# EasyEDA schematic EaseEDA_Stand_Kovalenko.json
TITLE: Stand; REV: 1.0; Date: 2021-12-19; Sheet: 1/1; Company: Your Company
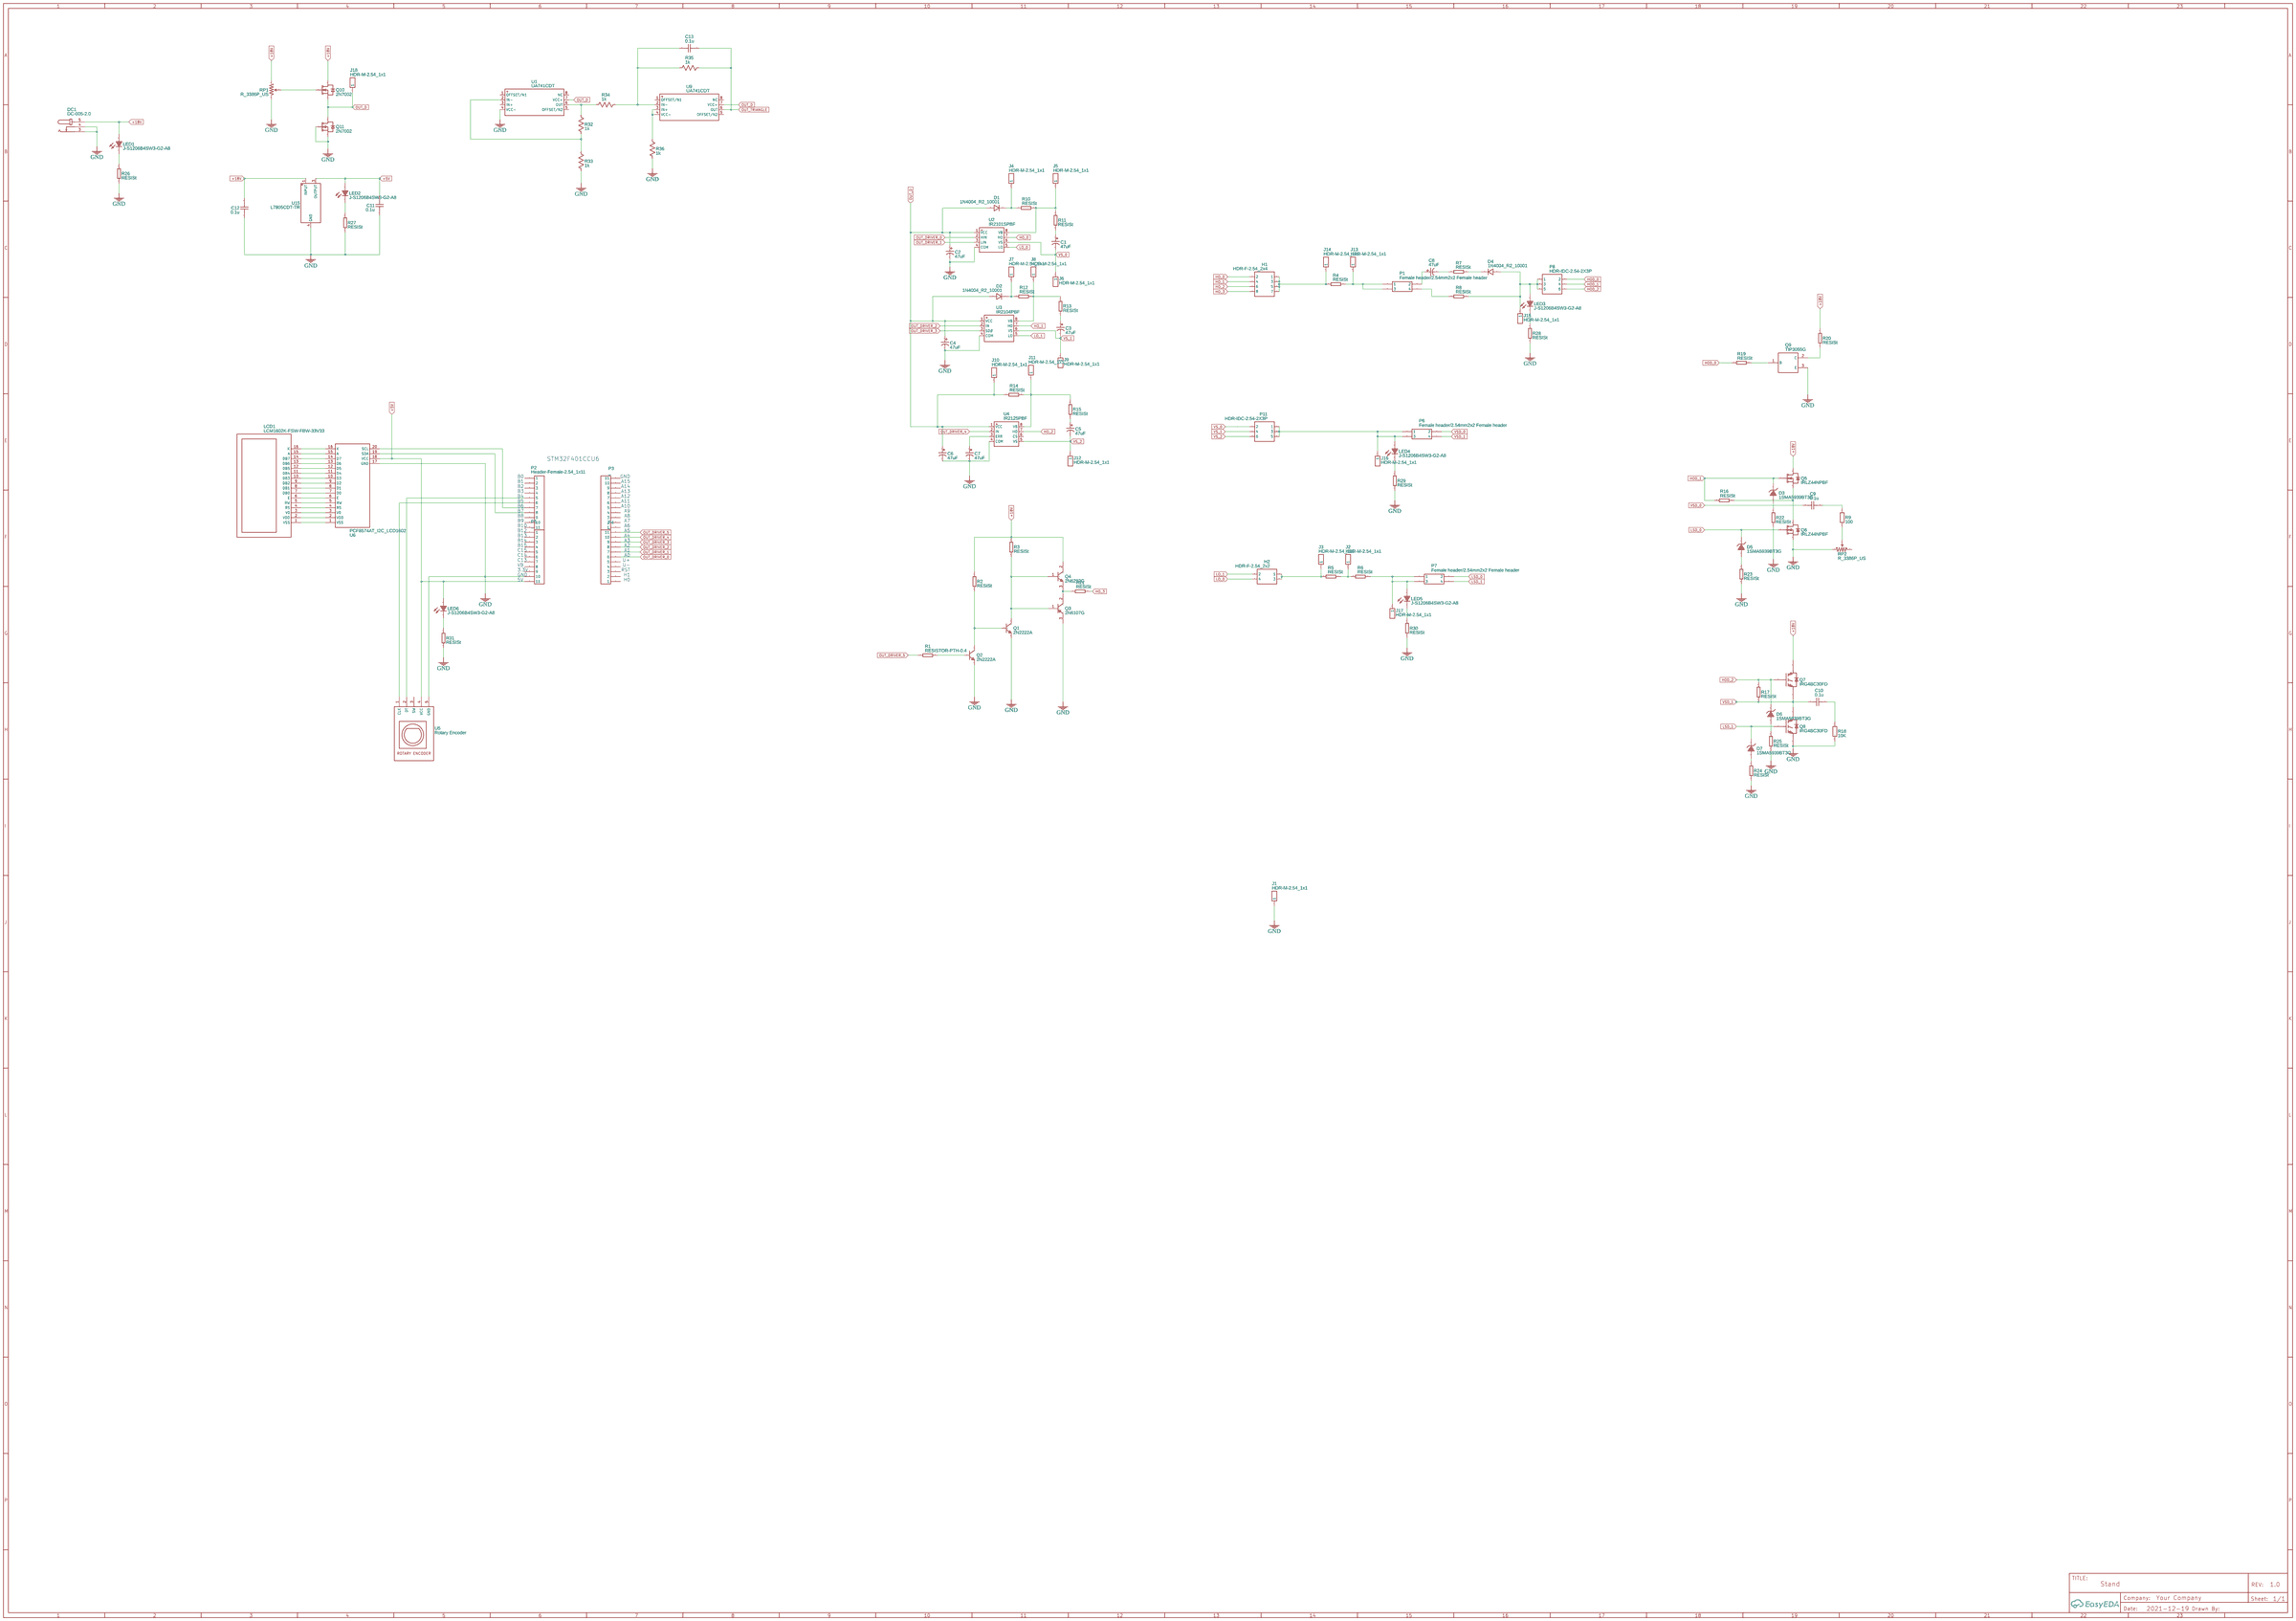
[diagram p0: schematic sheet]

## Parts
C1  47uF  [CAP-TH_BD6.3-P2.50-D1.0-FD]
C2  47uF  [CAP-TH_BD6.3-P2.50-D1.0-FD]
C3  47uF  [CAP-TH_BD6.3-P2.50-D1.0-FD]
C4  47uF  [CAP-TH_BD6.3-P2.50-D1.0-FD]
C5  47uF  [CAP-TH_BD6.3-P2.50-D1.0-FD]
C6  47uF  [CAP-TH_BD6.3-P2.50-D1.0-FD]
C7  47uF  [CAP-TH_BD6.3-P2.50-D1.0-FD]
C8  47uF  [CAP-TH_BD6.3-P2.50-D1.0-FD]
C9  0.1u  [C0603]
C10  0.1u  [C0603]
C11  0.1u  [C0603]
C12  0.1u  [C0603]
C13  0.1u  [C0603]
D1  1N4004_R2_10001  [DO-41_BD2.4-L4.7-P8.70-D0.9-RD]
D2  1N4004_R2_10001  [DO-41_BD2.4-L4.7-P8.70-D0.9-RD]
D3  1SMA5939BT3G  [SMA_L4.4-W2.6-LS5.2-RD]
D4  1N4004_R2_10001  [DO-41_BD2.4-L4.7-P8.70-D0.9-RD]
D5  1SMA5939BT3G  [SMA_L4.4-W2.6-LS5.2-RD]
D6  1SMA5939BT3G  [SMA_L4.4-W2.6-LS5.2-RD]
D7  1SMA5939BT3G  [SMA_L4.4-W2.6-LS5.2-RD]
DC1  DC-005-2.0  [DC-IN-TH_DC-005-2.0]
H1  HDR-F-2.54_2x4  [HDR-F-2.54_2X4]
H2  HDR-F-2.54_2x2  [HDR-F-2.54_2X2]
J1  HDR-M-2.54_1x1  [HDR-M-2.54_1X1]
J2  HDR-M-2.54_1x1  [HDR-M-2.54_1X1]
J3  HDR-M-2.54_1x1  [HDR-M-2.54_1X1]
J4  HDR-M-2.54_1x1  [HDR-M-2.54_1X1]
J5  HDR-M-2.54_1x1  [HDR-M-2.54_1X1]
J6  HDR-M-2.54_1x1  [HDR-M-2.54_1X1]
J7  HDR-M-2.54_1x1  [HDR-M-2.54_1X1]
J8  HDR-M-2.54_1x1  [HDR-M-2.54_1X1]
J9  HDR-M-2.54_1x1  [HDR-M-2.54_1X1]
J10  HDR-M-2.54_1x1  [HDR-M-2.54_1X1]
J11  HDR-M-2.54_1x1  [HDR-M-2.54_1X1]
J12  HDR-M-2.54_1x1  [HDR-M-2.54_1X1]
J13  HDR-M-2.54_1x1  [HDR-M-2.54_1X1]
J14  HDR-M-2.54_1x1  [HDR-M-2.54_1X1]
J15  HDR-M-2.54_1x1  [HDR-M-2.54_1X1]
J16  HDR-M-2.54_1x1  [HDR-M-2.54_1X1]
J17  HDR-M-2.54_1x1  [HDR-M-2.54_1X1]
J18  HDR-M-2.54_1x1  [HDR-M-2.54_1X1]
LCD1  LCM1602K-FSW-FBW-33V33  [MODULE-TH_LCM1602K]
LED1  J-S1206B4SW3-G2-A8  [LED1206-RD]
LED2  J-S1206B4SW3-G2-A8  [LED1206-RD]
LED3  J-S1206B4SW3-G2-A8  [LED1206-RD]
LED4  J-S1206B4SW3-G2-A8  [LED1206-RD]
LED5  J-S1206B4SW3-G2-A8  [LED1206-RD]
LED6  J-S1206B4SW3-G2-A8  [LED1206-RD]
P1  Female header/2.54mm2x2 Female header  [HDR-2X2/2.54]
P2  Header-Female-2.54_1x11  [HDR-11X1/2.54]
P3  _  [HDR-11X1/2.54]
P4  _  [HDR-11X1/2.54]
P5  _  [HDR-11X1/2.54]
P6  Female header/2.54mm2x2 Female header  [HDR-2X2/2.54]
P7  Female header/2.54mm2x2 Female header  [HDR-2X2/2.54]
P8  HDR-IDC-2.54-2X3P  [IDC-TH_6P-P2.54_C11214]
P11  HDR-IDC-2.54-2X3P  [IDC-TH_6P-P2.54_C11214]
Q1  2N2222A  [TO-92-3_L4.8-W3.7-P2.54-R]
Q2  2N2222A  [TO-92-3_L4.8-W3.7-P2.54-R]
Q3  2N6107G  [TO-220]
Q4  2N6292G  [TO-220]
Q5  IRLZ44NPBF  [TO-220-3_L10.0-W4.5-P2.54-T]
Q6  IRLZ44NPBF  [TO-220-3_L10.0-W4.5-P2.54-T]
Q7  IRG4BC30FD  [TO-220AB]
Q8  IRG4BC30FD  [TO-220AB]
Q9  TIP3055G  [ONSC-TO-247-3-340L-02]
Q10  2N7002  [SOT-23_L2.9-W1.3-P0.95-LS2.4-BR]
Q11  2N7002  [SOT-23_L2.9-W1.3-P0.95-LS2.4-BR]
R1  RESISTOR-PTH-0.4  [RTH025W]
R2  RESISt  [RTH025W]
R3  RESISt  [RTH025W]
R4  RESISt  [RTH025W]
R5  RESISt  [RTH025W]
R6  RESISt  [RTH025W]
R7  RESISt  [RTH025W]
R8  RESISt  [RTH025W]
R9  100  [RES-TH_BD9.0-L36.5-P40.50-D0.8]
R10  RESISt  [RTH025W]
R11  RESISt  [RTH025W]
R12  RESISt  [RTH025W]
R13  RESISt  [RTH025W]
R14  RESISt  [RTH025W]
R15  RESISt  [RTH025W]
R16  RESISt  [RTH025W]
R17  RESISt  [RTH025W]
R18  10K  [RES-TH_BD9.0-L36.5-P40.50-D0.8]
R19  RESISt  [RTH025W]
R20  RESISt  [RTH025W]
R21  RESISt  [RTH025W]
R22  RESISt  [RTH025W]
R23  RESISt  [RTH025W]
R24  RESISt  [RTH025W]
R25  RESISt  [RTH025W]
R26  RESISt  [RTH025W]
R27  RESISt  [RTH025W]
R28  RESISt  [RTH025W]
R29  RESISt  [RTH025W]
R30  RESISt  [RTH025W]
R31  RESISt  [RTH025W]
R32  1k  [R0603]
R33  1k  [R0603]
R34  1k  [R0603]
R35  1k  [R0603]
R36  1k  [R0603]
RP1  R_3386P_US  [RES-ADJ-TH_3386P]
RP2  R_3386P_US  [RES-ADJ-TH_3386P]
U1  UA741CDT  [SOIC-8_L4.9-W3.9-P1.27-LS6.0-BL]
U2  IR2101SPBF  [SOIC-8_L5.0-W4.0-P1.27-LS6.0-BL]
U3  IR2104PBF  [DIP-8_L9.9-W6.6-P2.54-LS7.62-BL]
U4  IR2125PBF  [PDIP-8_L9.3-W6.4-P2.54-LS7.6-BL]
U5  Rotary Encoder  [KY-040]
U6  PCF8574AT_I2C_LCD1602  [PCF8574AT_MODUL]
U9  UA741CDT  [SOIC-8_L4.9-W3.9-P1.27-LS6.0-BL]
U15  L7805CDT-TR  [DPAK_L6.5-W6.0-P2.29-LS9.9-TL]

## Library data of the parts
C1-C8 = RD1J476M6L011PC380: Supplier: LCSC; Supplier Part: C238012; Manufacturer: Samwha Capacitor; Contributor: LCSC; JLCPCB Part Class: Extended Part
C9-C13 = C_0603_US: Contributor: LCEDA_Lib
D1 D2 D4 = 1N4004_R2_10001: Supplier: LCSC; Supplier Part: C391322; Manufacturer: PANJIT International; Contributor: LCSC; JLCPCB Part Class: Extended Part
D3 D5-D7 = 1SMA5939BT3G: Supplier: LCSC; Supplier Part: C238874; Manufacturer: ON Semicon; Contributor: LCSC; JLCPCB Part Class: Extended Part
DC1 = DC-005-2.0: Supplier: LCSC; Supplier Part: C521451; Manufacturer: USAKRO(美韩); Contributor: LCSC; JLCPCB Part Class: Extended Part
H1 = HDR-F-2.54_2x4: Supplier Part: C239344; Supplier: LCSC; Contributor: LCEDA_Lib
H2 = HDR-F-2.54_2x2: Supplier Part: C239342; Supplier: LCSC; Contributor: LCEDA_Lib
J1-J18 = HDR-M-2.54_1x1: Supplier Part: C81276; Supplier: LCSC; Contributor: LCEDA_Lib
LCD1 = LCM1602K-FSW-FBW-33V33: Supplier: LCSC; Manufacturer: LONTECH; Supplier Part: C83271; JLCPCB Part Class: Extended Part
LED1-LED6 = J-S1206B4SW3-G2-A8: Supplier: LCSC; Supplier Part: C2917491; Manufacturer: null; JLCPCB Part Class: Extended Part; Contributor: LCSC
P1 P6 P7 = Female header/2.54mm2x2 Female header: Supplier Part: undefined; Supplier: LCSC; Manufacturer: ReliaPro
P2-P5 = Header-Female-2.54_1x11: Supplier Part: undefined; Supplier: LCSC; Manufacturer: LCSC; Manufacturer Part: Header-Female-2.54_1x10
P8 P11 = HDR-IDC-2.54-2X3P: Supplier: LCSC; Manufacturer: BOOMELE; Manufacturer Part: 2X3 2.54mm IDC Box; image: //image.lceda.cn/szlcsc/C11214.jpg; Supplier Part: C11214
Q1 Q2 = 2N2222A: Supplier: LCSC; Supplier Part: C358533; Manufacturer: Foshan Blue Rocket Elec; Contributor: LCSC; JLCPCB Part Class: Extended Part
Q3 = 2N6107G: Complementary Silicon Plastic Power Transistor, 3-Pin TO-220, Pb-Free, Tube
Q4 = 2N6292G: Complementary Silicon Plastic Power Transistor, 3-Pin TO-220, Pb-Free, Tube
Q5 Q6 = IRLZ44NPBF: Supplier: LCSC; Manufacturer: IR; Supplier Part: C38774; JLCPCB Part Class: Extended Part
Q7 Q8 = IRG4BC30FD: Insulated Gate Bipolar Transistor with Ultrafast Soft Recovery Diode
Q9 = TIP3055G: Complementary Silicon Power Transistor, 3-Pin TO-247, Pb-Free, Tube
Q10 Q11 = 2N7002: Supplier: LCSC; Manufacturer: Nexperia; Manufacturer Part: 2N7002,215; image: //image.lceda.cn/szlcsc/C65189.jpg; Supplier Part: C65189; Paste Type: expand; Contributor: LCEDA_Lib
R1-R8 R10-R17 R19-R31 = RESISTOR-PTH-0.4: Contributor: DangerousPrototype
R9 R18 = EWWR0010J10K0T9: Supplier: LCSC; Supplier Part: C349083; Manufacturer: ResistorToday; Contributor: LCSC
R32-R36 = R_0603_US: Contributor: LCEDA_Lib
RP1 RP2 = R_3386P_US: Supplier: LCSC; Contributor: LCEDA_Lib; value(Ω): 10K
U1 U9 = UA741CDT: Supplier: LCSC; Manufacturer: STMicroelectronics; Supplier Part: C7111; JLCPCB Part Class: Extended Part
U2 = IR2101SPBF: Supplier: LCSC; Supplier Part: C537541; Manufacturer: Infineon Technologies; Contributor: LCSC; JLCPCB Part Class: Extended Part
U3 = IR2104PBF: Supplier: LCSC; Manufacturer: IR; Supplier Part: C2959; JLCPCB Part Class: Extended Part
U4 = IR2125PBF: Supplier: LCSC; Supplier Part: C537562; Manufacturer: Infineon Technologies; Contributor: LCSC; JLCPCB Part Class: Extended Part
U5 = Rotary Encoder: Contributor: carlo78
U6 = PCF8574AT_I2C_LCD1602: Manufacturer Part: PCF8574AT_modul; Contributor: yps26111974
U15 = L7805CDT-TR: Supplier: LCSC; Supplier Part: C310413; Manufacturer: STMicroelectronics; Contributor: LCSC; JLCPCB Part Class: Extended Part

## Nets
+5V: C11.2 LED2.2(A) LED6.2(A) P5.11 U5.4(VCC) U6.18(VCC) U15.3(OUTPUT)
+18V: C12.2 DC1.5 LED1.2(A) Q4.2(C) Q5.2(D) Q7.2(C) Q10.3(D) R2.1 R3.1 R20.2 RP1.1 U15.1(INPUT)
GND: C2.2 C4.2 C6.2 C7.2 C11.1 C12.1 DC1.3 DC1.4 J1.1 P5.10 Q1.3(E) Q2.3(E) Q3.3(E) Q6.3(S) Q8.3(E) Q9.3(E) Q11.1(G) Q11.2(S) R18.2 R22.1 R23.1 R24.1 R25.1 R26.1 R27.1 R28.1 R29.1 R30.1 R31.1 R33.1 R36.2 RP1.3 RP2.1 U1.4(VCC-) U2.4(COM) U3.4(COM) U4.4(COM) U5.5(GND) U6.17(GND) U15.4(GND)
HO_0: H1.2 U2.7(HO)
HO_1: H1.4 U3.7(HO)
HO_2: H1.6 U4.7(HO)
HO_3: H1.8 R21.2
HOD_0: P8.2 R19.2
HOD_1: D3.1(C) P8.4 Q5.1(G) R16.2
HOD_2: D6.1(C) P8.6 Q7.1(G) R17.2
LO_0: H2.4 U2.5(LO)
LO_1: H2.2 U3.5(LO)
LSD_0: D5.1(C) P7.2 Q6.1(G)
LSD_1: D7.1(C) P7.4 Q8.1(G)
OUT_D: C2.1 C4.1 C6.1 D1.2(A) D2.2(A) J10.1 J18.1 Q10.2(S) Q11.3(D) R14.1 U1.7(VCC+) U2.1(VCC) U3.1(VCC) U4.1(VCC) U9.7(VCC+)
OUT_DRIVER_0: P4.6 U2.2(HIN)
OUT_DRIVER_1: P4.7 U2.3(LIN)
OUT_DRIVER_2: P4.8 U3.2(IN)
OUT_DRIVER_3: P4.9 U3.3(SD#)
OUT_DRIVER_4: P4.10 U4.2(IN)
OUT_DRIVER_5: P4.11 R1.1
OUT_TRIANGLE: C13.1 R35.1 U9.6(OUT)
VS_0: C1.2 J6.1 P11.2 U2.6(VS)
VS_1: C3.2 J9.1 P11.4 U3.6(VS)
VS_2: C5.2 J12.1 P11.6 U4.5(VS)
VSD_0: C9.1 P6.2
VSD_1: C10.1 P6.4 Q7.3(E) Q8.2(C) R17.1
Net-(C1-1): C1.1 R11.2
Net-(C3-1): C3.1 R13.1
Net-(C5-1): C5.1 R15.1
Net-(C7-1): C7.1 U4.3(ERR)
Net-(C8-1): C8.1 P1.2
Net-(C8-2): C8.2 R7.2
Net-(C9-2): C9.2 R9.1
Net-(C10-2): C10.2 R18.1
Net-(C13-2): C13.2 R34.1 R35.2 U9.2(IN-)
Net-(D1-1): D1.1(C) J4.1 R10.1
Net-(D2-1): D2.1(C) J7.1 R12.1
Net-(D3-2): D3.2(A) R22.2
Net-(D4-1): D4.1(C) R7.1
Net-(D4-2): D4.2(A) J15.1 LED3.2(A) P8.1 P8.3 P8.5 R8.1
Net-(D5-2): D5.2(A) R23.2
Net-(D6-2): D6.2(A) R25.2
Net-(D7-2): D7.2(A) R24.2
Net-(H1-1): H1.1 H1.3 H1.5 H1.7 J14.1 R4.2
Net-(H2-1): H2.1 H2.3 J3.1 R5.2
Net-(J2-1): J2.1 R5.1 R6.2
Net-(J5-1): J5.1 R10.2 R11.1 U2.8(VB)
Net-(J8-1): J8.1 R12.2 R13.2 U3.8(VB)
Net-(J11-1): J11.1 R14.2 R15.2 U4.8(VB)
Net-(J13-1): J13.1 P1.1 P1.3 R4.1
Net-(J16-1): J16.1 LED4.2(A) P6.1 P6.3 P11.1 P11.3 P11.5
Net-(J17-1): J17.1 LED5.2(A) P7.1 P7.3 R6.1
Net-(LCD1-1): LCD1.1(VSS) U6.1(VSS)
Net-(LCD1-2): LCD1.2(VDD) U6.2(VDD)
Net-(LCD1-3): LCD1.3(V0) U6.3(V0)
Net-(LCD1-4): LCD1.4(RS) U6.4(RS)
Net-(LCD1-5): LCD1.5(RW) U6.5(RW)
Net-(LCD1-6): LCD1.6(E) U6.6(E)
Net-(LCD1-7): LCD1.7(DB0) U6.7(D0)
Net-(LCD1-8): LCD1.8(DB1) U6.8(D1)
Net-(LCD1-9): LCD1.9(DB2) U6.9(D2)
Net-(LCD1-10): LCD1.10(DB3) U6.10(D3)
Net-(LCD1-11): LCD1.11(DB4) U6.11(D4)
Net-(LCD1-12): LCD1.12(DB5) U6.12(D5)
Net-(LCD1-13): LCD1.13(DB6) U6.13(D6)
Net-(LCD1-14): LCD1.14(DB7) U6.14(D7)
Net-(LCD1-15): LCD1.15(A) U6.15(A)
Net-(LCD1-16): LCD1.16(K) U6.16(K)
Net-(LED1-1): LED1.1(K) R26.2
Net-(LED2-1): LED2.1(K) R27.2
Net-(LED3-1): LED3.1(K) R28.2
Net-(LED4-1): LED4.1(K) R29.2
Net-(LED5-1): LED5.1(K) R30.2
Net-(LED6-1): LED6.1(K) R31.2
Net-(P1-4): P1.4 R8.2
Net-(P2-5): P2.5 U5.2(DT)
Net-(P2-6): P2.6 U5.1(CLK)
Net-(P2-7): P2.7 U6.20(SCL)
Net-(P2-8): P2.8 U6.19(SDA)
Net-(Q1-1): Q1.1(C) Q3.1(B) Q4.1(B) R3.2
Net-(Q1-2): Q1.2(B) Q2.1(C) R2.2
Net-(Q2-2): Q2.2(B) R1.2
Net-(Q3-2): Q3.2(C) Q4.3(E) R21.1
Net-(Q5-3): Q5.3(S) Q6.2(D) R16.1
Net-(Q9-1): Q9.1(B) R19.1
Net-(Q9-2): Q9.2(C) R20.1
Net-(Q10-1): Q10.1(G) RP1.2
Net-(R9-2): R9.2 RP2.2
Net-(R32-1): R32.1 R33.2 U1.2(IN-)
Net-(R32-2): R32.2 R34.2 U1.6(OUT)
Net-(R36-1): R36.1 U9.3(IN+) U9.4(VCC-)

Not connected (* = marked no-connect by the designer): P2 1 2 3 4 9 10 11; P3 1 2 3 4 5 6 7 8 9 10 11; P4 1 2 3 4 5; P5 1 2 3 4 5 6 7 8 9; RP2 3; U1 1(OFFSET/N1) 3(IN+) 5(OFFSET/N2) 8(NC); U4 6(CS); U5 3(SW); U9 1(OFFSET/N1) 5(OFFSET/N2) 8(NC)

## Notes on the sheet
- STM32F401CCU6
- B0
- GND
- B1
- A15
- B2
- A14
- B3
- A13
- B4
- B5
- A11
- A12
- B6
- A10
- B7
- A9
- B8
- A8
- B9
- A7
- B10
- B12
- A5
- A6
- B13
- A4
- B14
- A3
- B15
- A2
- C15
- A1
- C14
- A0
- C13
- VB
- U+
- U-
- 3.3V
- RST
- GND
- H1
- 5V
- H0
